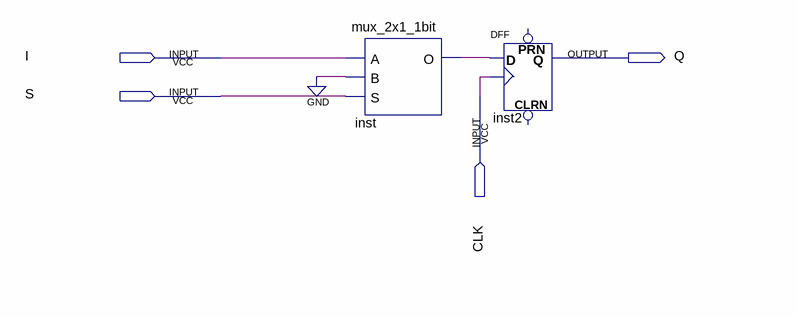
[diagram p0: schematic sheet]
// Quartus schematic register.bdf as structural Verilog: 2 symbols, 4 pins
module register (
  input  I,
  input  S,
  input  CLK,
  output Q
);

  wire inst_o;

  mux_2x1_1bit inst (.A(I), .B(1'b0), .S(S), .O(inst_o));
  DFF inst2 (.CLK(CLK), .D(inst_o), .Q(Q));  // open: CLRN, PRN
endmodule
